# EAGLE design AR1 (EAGLE 7.3.0)
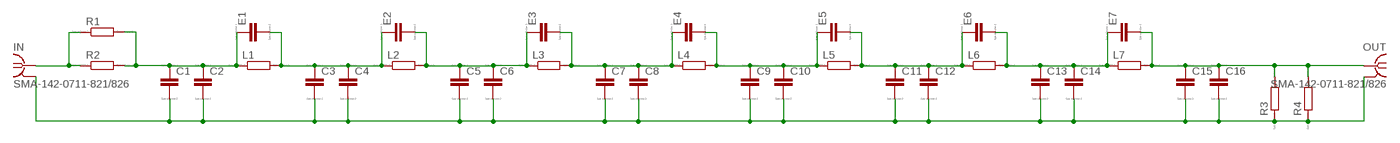
[diagram p0: schematic, sheet 1, overview]
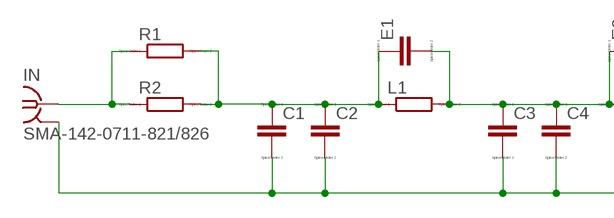
[diagram p1: schematic, sheet 1, part 1 of 4]
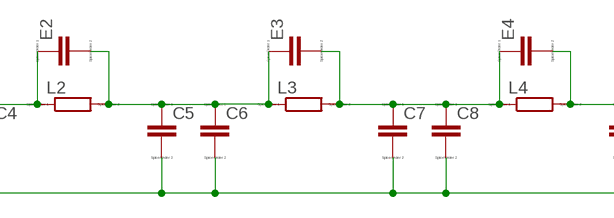
[diagram p2: schematic, sheet 1, part 2 of 4]
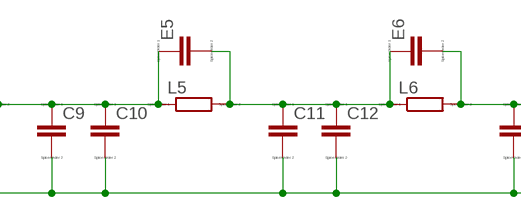
[diagram p3: schematic, sheet 1, part 3 of 4]
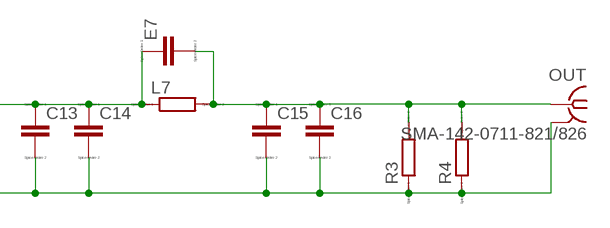
[diagram p4: schematic, sheet 1, part 4 of 4]

## Parts
C1  C  [C0805]
C2  C  [C0805]
C3  C  [C0805]
C4  C  [C0805]
C5  C  [C0805]
C6  C  [C0805]
C7  C  [C0805]
C8  C  [C0805]
C9  C  [C0805]
C10  C  [C0805]
C11  C  [C0805]
C12  C  [C0805]
C13  C  [C0805]
C14  C  [C0805]
C15  C  [C0805]
C16  C  [C0805]
E1  C  [C0805]
E2  C  [C0805]
E3  C  [C0805]
E4  C  [C0805]
E5  C  [C0805]
E6  C  [C0805]
E7  C  [C0805]
IN  SMA-142-0711-821/826  [J502-ND-142-0711-821/826]
L1  R  [R0805]
L2  R  [R0805]
L3  R  [R0805]
L4  R  [R0805]
L5  R  [R0805]
L6  R  [R0805]
L7  R  [R0805]
OUT  SMA-142-0711-821/826  [J502-ND-142-0711-821/826]
R1  R  [R0805]
R2  R  [R0805]
R3  R  [R0805]
R4  R  [R0805]

## Nets
GND: C1.2 C2.2 C3.2 C4.2 C5.2 C6.2 C7.2 C8.2 C9.2 C10.2 C11.2 C12.2 C13.2 C14.2 C15.2 C16.2 IN.G@1 IN.G@2 IN.G@3 IN.G@4 OUT.G@1 OUT.G@2 OUT.G@3 OUT.G@4 R3.1 R4.1
N$2: C1.1 C2.1 E1.1 L1.1 R1.2 R2.2
N$3: IN.1 R1.1 R2.1
N$4: C15.1 C16.1 E7.2 L7.2 OUT.1 R3.2 R4.2
N$7: C3.1 C4.1 E1.2 E2.1 L1.2 L2.1
N$8: C5.1 C6.1 E2.2 E3.1 L2.2 L3.1
N$11: C7.1 C8.1 E3.2 E4.1 L3.2 L4.1
N$13: C9.1 C10.1 E4.2 E5.1 L4.2 L5.1
N$14: C11.1 C12.1 E5.2 E6.1 L5.2 L6.1
N$15: C13.1 C14.1 E6.2 E7.1 L6.2 L7.1

## Library data of the parts
C1-C16 E1-E7 = eagle-ltspice:C: CAPACITOR, European symbol; SPICEMODEL: NONE; SPICEPREFIX: C
IN OUT = con-coax:SMA-: SMA 50 Ohm End Launch Jack Receptacle - Round Contact Johnson Components Source: www.johnsoncomponents.com .. J502-ND.pdf; MF: JOHNSON COMPONENTS; MPN: 142-0711-821; OC_FARNELL: 1019328; OC_NEWARK: 16F3627
L1-L7 R1-R4 = eagle-ltspice:R: RESISTOR, European symbol; SPICEMODEL: NONE; SPICEPREFIX: R

## Board
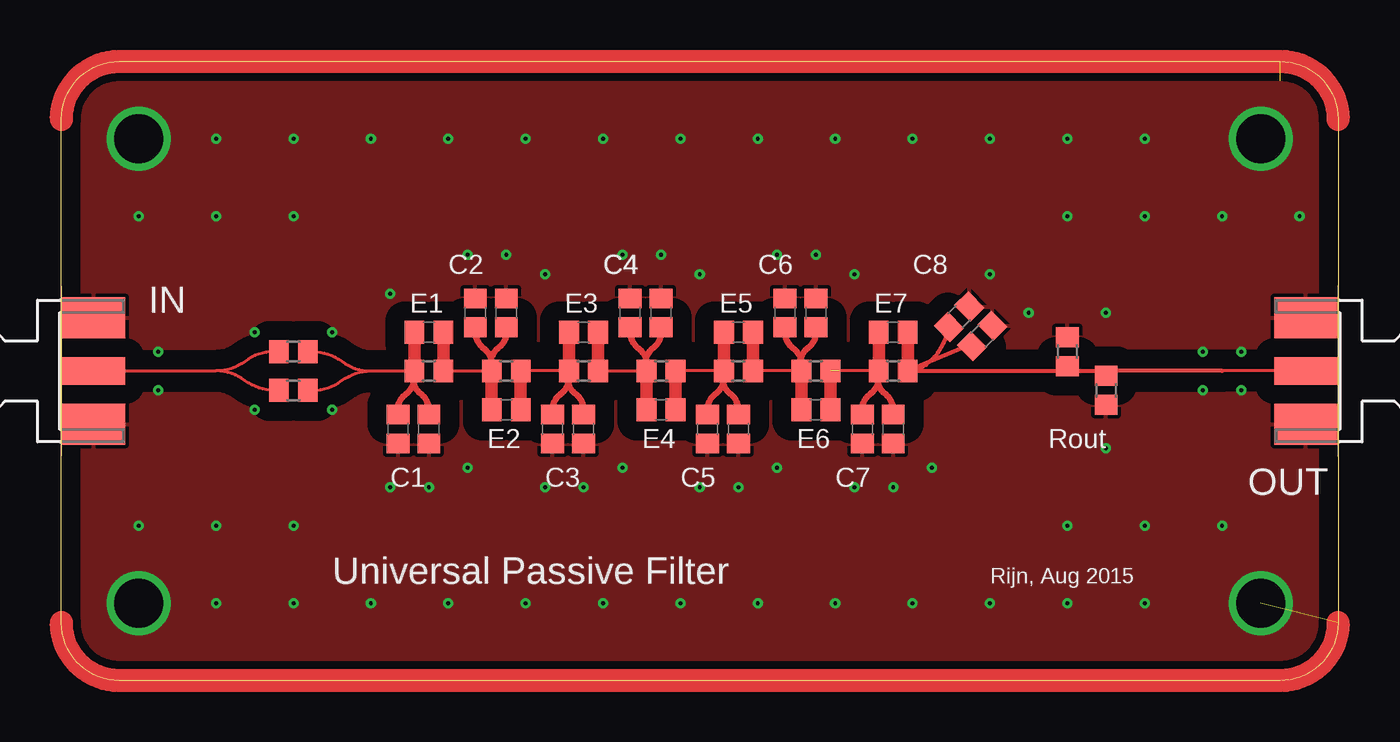
[diagram p5: board, top side]
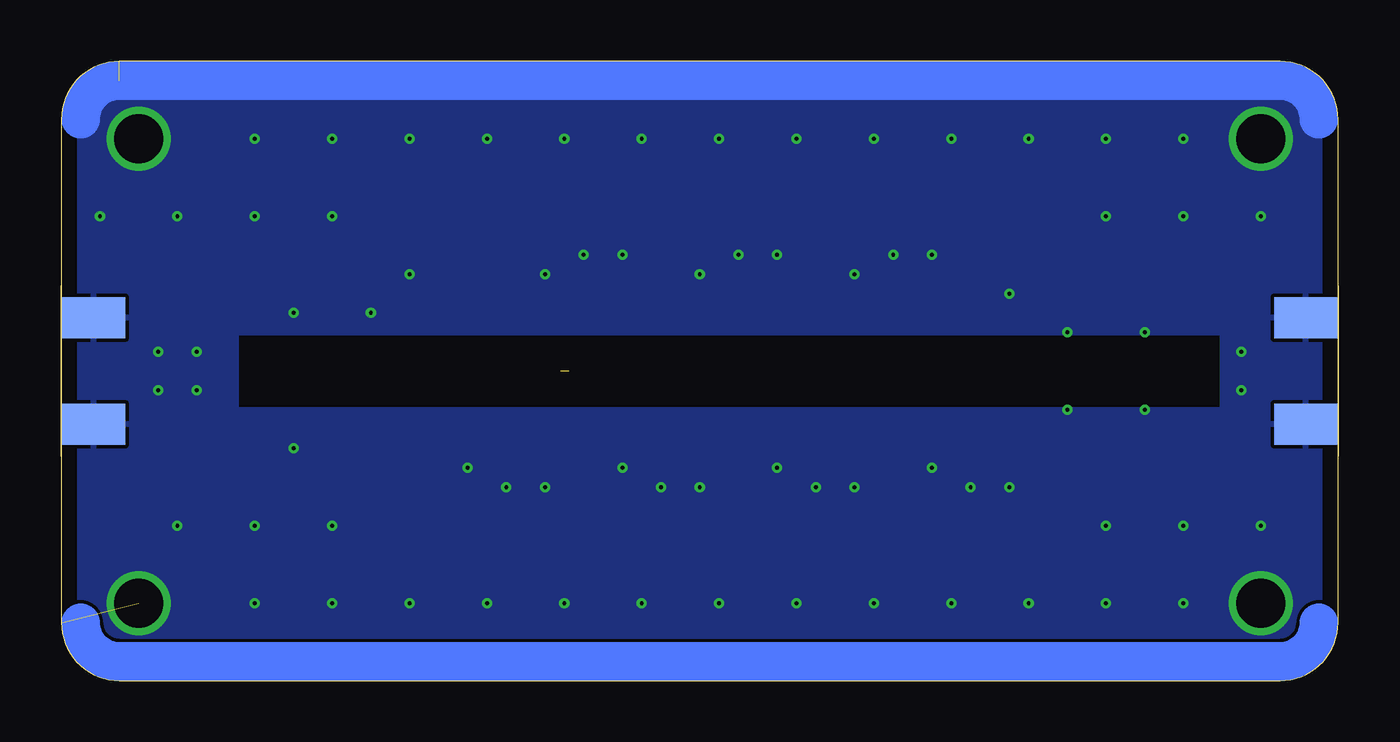
[diagram p6: board, bottom side, seen from below]

Size 83.82 x 40.64 mm. Coordinates in mm from the lower left corner, seen from the top.
Outline: 3.81,40.64 arc90 0,36.83 0,3.81 arc90 3.81,0 80.01,0 arc90 83.82,3.81 83.82,36.83 arc90 80.01,40.64
Outline: 3.81,40.64 80.01,40.64
Outline: 3.81,40.64 80.01,40.64
Copper layers (1*16): Top 0.035mm / dielectric 1.5mm / Bottom 0.035mm
Design rules "default": minimum track width 10mil, minimum drill 24mil, track to track 8mil, track to pad 8mil, pad to pad 8mil, via to via 8mil, smd to smd 8mil, copper to edge 40mil, drill to drill 8mil, minimum pad ring 10mil, minimum via ring 8mil, stop-mask expansion 4mil, vias tented up to drill 0mil, thermal gap 10mil

### Footprints (pad centres in the part's own frame; a part is rotated, then mirrored left to right if it is on the bottom)
C0805 = smd 1.3 x 1.5: 1 -0.95,0; 2 0.95,0
J502-ND-142-0711-821/826 = smd 4.191 x 1.778: 1 2.115,0 | smd 4.191 x 2.667: G@1 2.115,3.495; G@2 2.115,-3.495 | smd 4.191 x 2.667 bottom: G@3 2.115,3.495; G@4 2.115,-3.495
R0805 = smd 1.3 x 1.5: 1 -0.95,0; 2 0.95,0

### Placement (x,y rotation side)
C1  24.13,16.51 270 top
C2  22.1,16.51 270 top
C3  27.18,24.13 90 top
C4  29.21,24.13 90 top
C5  34.29,16.51 270 top
C6  32.26,16.51 270 top
C7  39.37,24.13 90 top
C8  37.34,24.13 90 top
C9  44.45,16.51 270 top
C10  42.42,16.51 270 top
C11  49.53,24.13 90 top
C12  47.5,24.13 90 top
C13  52.58,16.51 270 top
C14  54.61,16.51 270 top
C15  58.93,23.88 45 top
C16  60.45,22.61 45 top
E1  24.13,22.86 0 top
E2  29.21,17.78 0 top
E3  34.29,22.86 0 top
E4  39.37,17.78 0 top
E5  44.45,22.86 0 top
E6  49.53,17.78 0 top
E7  54.61,22.86 0 top
IN  0,20.32 0 top
L1  24.13,20.32 0 top
L2  29.21,20.32 0 top
L3  34.29,20.32 0 top
L4  39.37,20.32 0 top
L5  44.45,20.32 0 top
L6  49.53,20.32 0 top
L7  54.61,20.32 0 top
OUT  83.82,20.32 180 top
R1  15.24,19.05 0 top
R2  15.24,21.59 0 top
R3  66.04,21.59 270 top
R4  68.58,19.05 90 top

### Tracks (layer width: path | path; a pad name or v marks a point on that pad's centre or on a via)
GND  (via drill 0.25 pad 0.25, 3.2 pad 3.81)  (2 unrouted)
  Top 1.524: 0,36.83 arc-90 3.81,40.64 80.01,40.64 arc-90 83.82,36.83 | 83.82,3.81 arc-90 80.01,0 3.81,0 arc-90 0,3.81
  Bottom 2.54: 1.27,36.83 arc-90 3.81,39.37 80.01,39.37 arc-90 82.55,36.83
  other vias: 5.08,35.56 5.08,5.08 78.74,5.08 78.74,35.56 74.93,21.59 74.93,19.05 77.47,21.59 77.47,19.05 60.96,26.67 17.78,22.86 12.7,22.86 12.7,17.78 17.78,17.78 6.35,21.59 6.35,19.05 26.67,27.94 29.21,27.94 31.75,26.67 36.83,27.94 39.37,27.94 41.91,26.67 46.99,27.94 49.53,27.94 52.07,26.67 21.59,12.7 24.13,12.7 26.67,13.97 31.75,12.7 34.29,12.7 36.83,13.97 44.45,12.7 46.99,13.97 54.61,12.7 57.15,13.97 52.07,12.7 44.45,12.7 41.91,12.7 21.59,25.4 63.5,24.13 68.58,24.13 68.58,15.24 5.08,10.16 10.16,10.16 10.16,5.08 15.24,5.08 20.32,5.08 25.4,5.08 30.48,5.08 35.56,5.08 40.64,5.08 45.72,5.08 50.8,5.08 55.88,5.08 60.96,5.08 66.04,5.08 71.12,5.08 76.2,10.16 81.28,30.48 76.2,30.48 71.12,35.56 66.04,35.56 60.96,35.56 55.88,35.56 50.8,35.56 45.72,35.56 40.64,35.56 35.56,35.56 30.48,35.56 25.4,35.56 20.32,35.56 15.24,35.56 10.16,35.56 5.08,30.48 15.24,10.16 71.12,10.16 66.04,10.16 71.12,30.48 66.04,30.48 10.16,30.48 15.24,30.48
  pour Bottom: 3.81,0 arc-90 0,3.81
  pour Top (isolate 1.27): 0,36.83 arc-90 3.81,40.64 80.01,40.64 arc-90 83.82,36.83 83.82,3.81 arc-90 80.01,0 3.81,0 arc-90 0,3.81
  pour Bottom: 0,3.81 arc90 3.81,0 80.01,0 arc90 83.82,3.81 83.82,16.51 arc90 82.55,17.78 1.27,17.78 arc90 0,16.51
  pour Bottom: 0,36.83 arc-90 3.81,40.64 80.01,40.64 arc-90 83.82,36.83 83.82,24.13 arc-90 82.55,22.86 1.27,22.86 arc-90 0,24.13
  pour Bottom: 0,26.67 5.08,26.67 arc-90 7.62,24.13 7.62,15.24 arc-90 6.35,13.97 0,13.97
  pour Bottom: 83.82,26.67 74.93,26.67 arc90 72.39,24.13 72.39,16.51 arc90 74.93,13.97 83.82,13.97
N$2
  Top 0.203: R2.2 16.51,21.59 arc-37 18.41,20.95 arc37 20.32,20.32 | 20.32,20.32 L1.1 | R1.2 16.51,19.05 arc37 18.41,19.68 arc-37 20.32,20.32
  Top 0.406: C1.1 24.13,17.78 arc53 23.62,18.8 arc-74 L1.1 arc-65 22.61,18.8 arc53 22.1,17.78 C2.1
  Top 0.813: E1.1 L1.1
N$3
  Top 0.203: R2.1 13.97,21.59 arc37 12.06,20.95 arc-37 10.16,20.32 | R1.1 13.97,19.05 arc-37 12.06,19.68 arc37 10.16,20.32 | IN.1 10.16,20.32
N$4
  Top 0.203: 56.13,20.32 L7.2 | OUT.1 76.2,20.32
  Top 0.254: C15.1 58.17,22.86 arc-48 56.13,20.32 66.04,20.32 | C16.1 arc-90 59.69,21.84 59.18,21.84 L7.2 | 66.04,20.32 R3.2 | 66.04,20.32 68.58,20.32 | 76.2,20.32 68.58,20.32 | 68.58,20.32 R4.2
  Top 0.813: E7.2 L7.2
N$7
  Top 0.203: L1.2 L2.1
  Top 0.406: C3.1 27.18,22.86 arc53 27.69,21.84 arc-65 L2.1 arc-74 28.7,21.84 arc53 29.21,22.86 C4.1
  Top 0.813: E1.2 L1.2 | L2.1 E2.1
N$8
  Top 0.203: L3.1 L2.2
  Top 0.406: C6.1 32.26,17.78 arc-53 32.77,18.8 arc65 L3.1 arc74 33.78,18.8 arc-53 34.29,17.78 C5.1 34.29,17.27
  Top 0.813: L2.2 E2.2 | E3.1 L3.1
N$11
  Top 0.203: L3.2 L4.1
  Top 0.406: C8.1 37.34,22.86 arc53 37.85,21.84 arc-65 L4.1 arc-74 38.86,21.84 arc53 39.37,22.86 C7.1 39.37,23.37
  Top 0.813: E3.2 L3.2 | L4.1 E4.1
N$12
  Bottom 2.54: 82.55,3.81 arc-90 80.01,1.27 3.81,1.27 arc-90 1.27,3.81
N$13
  Top 0.203: L5.1 L4.2
  Top 0.406: 42.42,17.27 C10.1 42.42,17.78 arc-53 42.93,18.8 arc65 L5.1 arc74 43.94,18.8 arc-53 44.45,17.78 C9.1
  Top 0.813: L4.2 E4.2 | E5.1 L5.1
N$14
  Top 0.203: 48.77,20.32 L6.1 L5.2
  Top 0.406: C12.1 47.5,22.86 arc53 48.01,21.84 arc-65 L6.1 arc-74 49.02,21.84 arc53 49.53,22.86 C11.1 49.53,23.37
  Top 0.813: E5.2 L5.2 | L6.1 E6.1
N$15  (1 unrouted)
  Top 0.203: L7.1 51.05,20.32 51.05,20.57
  Top 0.406: C13.1 52.58,17.78 arc-53 53.09,18.8 arc65 L7.1 arc74 54.1,18.8 arc-53 54.61,17.78 C14.1 54.61,17.27
  Top 0.813: L6.2 E6.2 | E7.1 L7.1

### Text on the board
tNames: C2 | C4 | C4 | C6 | C8 | E4 | Rout | C1 | C3 | C5 | C7 | Universal Passive Filter | Rijn, Aug 2015